# EAGLE design DAC STM32 Board v3 (EAGLE 9.3.1)
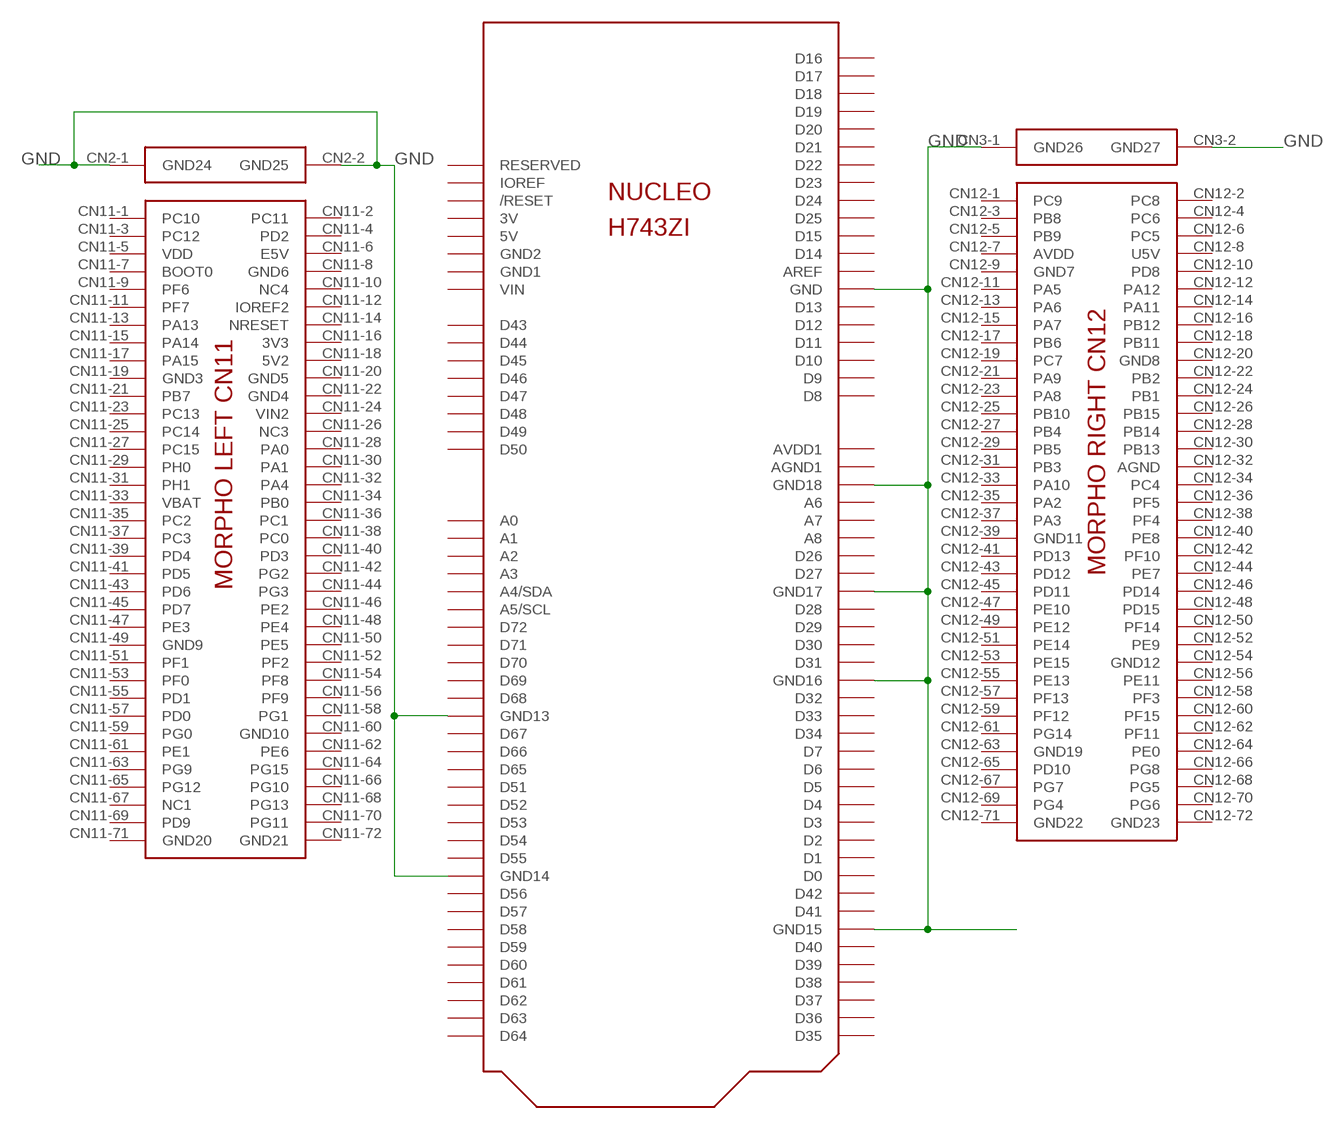
[diagram p0: schematic, sheet 1, part 1 of 2]
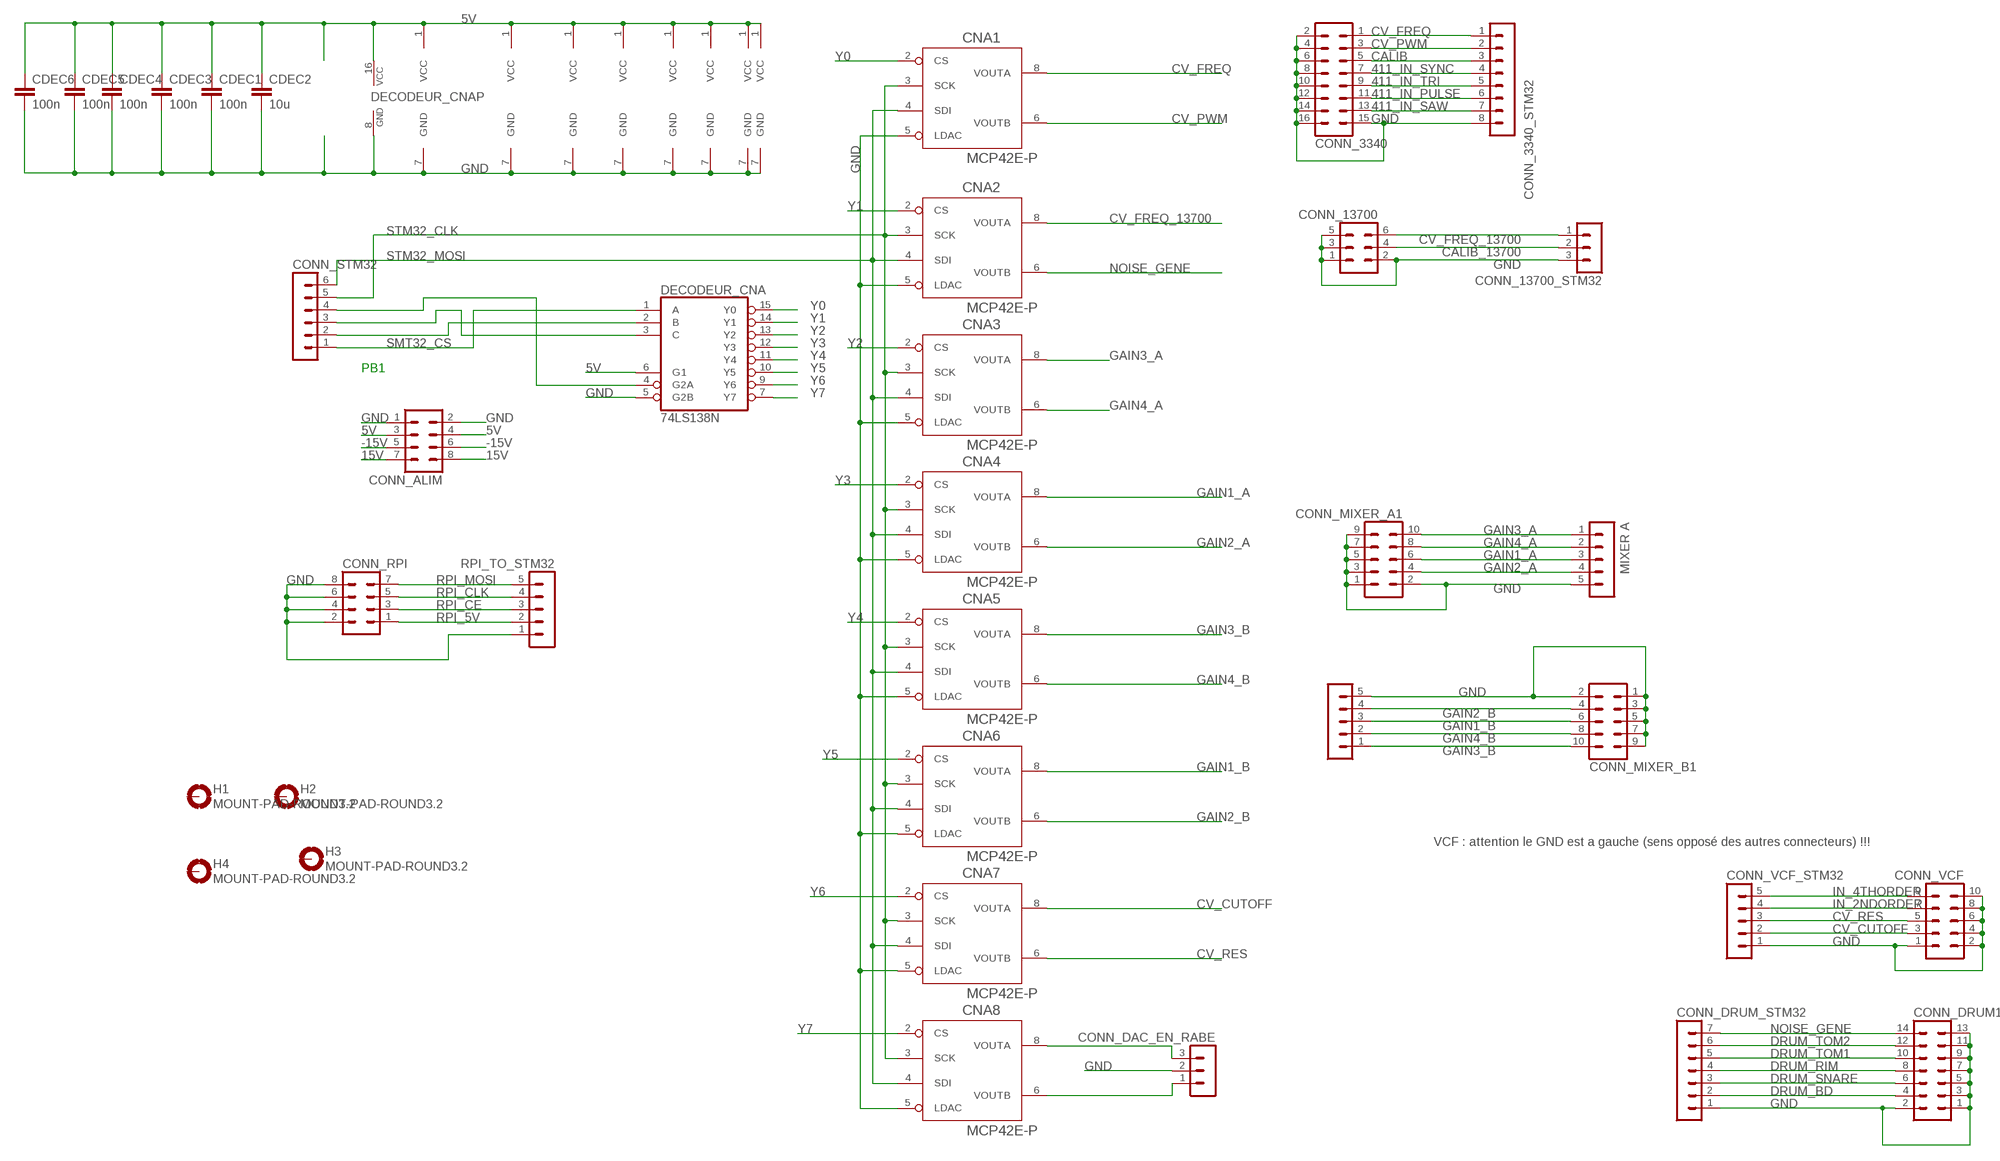
[diagram p1: schematic, sheet 1, part 2 of 2]

## Parts
CDEC1  100n  C-EU050-025X075  [C050-025X075]
CDEC2  10u  C-EU050-025X075  [C050-025X075]
CDEC3  100n  C-EU075-032X103  [C075-032X103]
CDEC4  100n  C-EU075-032X103  [C075-032X103]
CDEC5  100n  C-EU075-032X103  [C075-032X103]
CDEC6  100n  C-EU075-032X103  [C075-032X103]
CNA1  MCP42E-P  [DIL08]
CNA2  MCP42E-P  [DIL08]
CNA3  MCP42E-P  [DIL08]
CNA4  MCP42E-P  [DIL08]
CNA5  MCP42E-P  [DIL08]
CNA6  MCP42E-P  [DIL08]
CNA7  MCP42E-P  [DIL08]
CNA8  MCP42E-P  [DIL08]
CONN_3340  MA08-2  [MA08-2]
CONN_3340_STM32  MA08-1  [MA08-1]
CONN_13700  MA03-2  [MA03-2]
CONN_13700_STM32  MA03-1  [MA03-1]
CONN_ALIM  MA04-2  [MA04-2]
CONN_DAC_EN_RABE  MA03-1  [MA03-1]
CONN_DRUM1  MA07-2  [MA07-2]
CONN_DRUM_STM32  MA07-1  [MA07-1]
CONN_MIXER_A1  MA05-2  [MA05-2]
CONN_MIXER_A_STM32  MA05-1  [MA05-1]
CONN_MIXER_B1  MA05-2  [MA05-2]
CONN_MIXER_B_STM32  MA05-1  [MA05-1]
CONN_RPI  MA04-2  [MA04-2]
CONN_STM32  MA06-1  [MA06-1]
CONN_VCF  MA05-2  [MA05-2]
CONN_VCF_STM32  MA05-1  [MA05-1]
DECODEUR_CNA  74LS138N  [DIL16]
H1  MOUNT-PAD-ROUND3.2  [3,2-PAD]
H2  MOUNT-PAD-ROUND3.2  [3,2-PAD]
H3  MOUNT-PAD-ROUND3.2  [3,2-PAD]
H4  MOUNT-PAD-ROUND3.2  [3,2-PAD]
RPI_TO_STM32  MA05-1  [MA05-1]
U$1  NUCLEO_H743ZI  [NUCLEO_BRD144]

## Nets
5V: CDEC1.1 CDEC2.1 CDEC3.1 CDEC4.1 CDEC5.1 CDEC6.1 CNA1.1(VCC) CNA2.1(VCC) CNA3.1(VCC) CNA4.1(VCC) CNA5.1(VCC) CNA6.1(VCC) CNA7.1(VCC) CNA8.1(VCC) CONN_ALIM.3 CONN_ALIM.4 DECODEUR_CNA.6(G1) DECODEUR_CNA.16(VCC)
15V: CONN_ALIM.7 CONN_ALIM.8
411_IN_PULSE: CONN_3340.11 CONN_3340_STM32.6
411_IN_SAW: CONN_3340.13 CONN_3340_STM32.7
411_IN_SYNC: CONN_3340.7 CONN_3340_STM32.4
411_IN_TRI: CONN_3340.9 CONN_3340_STM32.5
-15V: CONN_ALIM.5 CONN_ALIM.6
CALIB: CONN_3340.5 CONN_3340_STM32.3
CALIB_13700: CONN_13700.4 CONN_13700_STM32.2
CV_CUTOFF: CNA7.8(VOUTA) CONN_VCF.3 CONN_VCF_STM32.2
CV_FREQ: CNA1.8(VOUTA) CONN_3340.1 CONN_3340_STM32.1
CV_FREQ_13700: CNA2.8(VOUTA) CONN_13700.6 CONN_13700_STM32.1
CV_PWM: CNA1.6(VOUTB) CONN_3340.3 CONN_3340_STM32.2
CV_RES: CNA7.6(VOUTB) CONN_VCF.5 CONN_VCF_STM32.3
DRUM_BD: CONN_DRUM1.4 CONN_DRUM_STM32.2
DRUM_RIM: CONN_DRUM1.8 CONN_DRUM_STM32.4
DRUM_SNARE: CONN_DRUM1.6 CONN_DRUM_STM32.3
DRUM_TOM1: CONN_DRUM1.10 CONN_DRUM_STM32.5
DRUM_TOM2: CONN_DRUM1.12 CONN_DRUM_STM32.6
GAIN1_A: CNA4.8(VOUTA) CONN_MIXER_A1.6 CONN_MIXER_A_STM32.3
GAIN1_B: CNA6.8(VOUTA) CONN_MIXER_B1.6 CONN_MIXER_B_STM32.3
GAIN2_A: CNA4.6(VOUTB) CONN_MIXER_A1.4 CONN_MIXER_A_STM32.4
GAIN2_B: CNA6.6(VOUTB) CONN_MIXER_B1.4 CONN_MIXER_B_STM32.4
GAIN3_A: CNA3.8(VOUTA) CONN_MIXER_A1.10 CONN_MIXER_A_STM32.1
GAIN3_B: CNA5.8(VOUTA) CONN_MIXER_B1.10 CONN_MIXER_B_STM32.1
GAIN4_A: CNA3.6(VOUTB) CONN_MIXER_A1.8 CONN_MIXER_A_STM32.2
GAIN4_B: CNA5.6(VOUTB) CONN_MIXER_B1.8 CONN_MIXER_B_STM32.2
GND: CDEC1.2 CDEC2.2 CDEC3.2 CDEC4.2 CDEC5.2 CDEC6.2 CNA1.5(LDAC) CNA1.7(GND) CNA2.5(LDAC) CNA2.7(GND) CNA3.5(LDAC) CNA3.7(GND) CNA4.5(LDAC) CNA4.7(GND) CNA5.5(LDAC) CNA5.7(GND) CNA6.5(LDAC) CNA6.7(GND) CNA7.5(LDAC) CNA7.7(GND) CNA8.5(LDAC) CNA8.7(GND) CONN_3340.2 CONN_3340.4 CONN_3340.6 CONN_3340.8 CONN_3340.10 CONN_3340.12 CONN_3340.14 CONN_3340.15 CONN_3340.16 CONN_3340_STM32.8 CONN_13700.1 CONN_13700.2 CONN_13700.3 CONN_13700.5 CONN_13700_STM32.3 CONN_ALIM.1 CONN_ALIM.2 CONN_DAC_EN_RABE.2 CONN_DRUM1.1 CONN_DRUM1.2 CONN_DRUM1.3 CONN_DRUM1.5 CONN_DRUM1.7 CONN_DRUM1.9 CONN_DRUM1.11 CONN_DRUM1.13 CONN_DRUM_STM32.1 CONN_MIXER_A1.1 CONN_MIXER_A1.2 CONN_MIXER_A1.3 CONN_MIXER_A1.5 CONN_MIXER_A1.7 CONN_MIXER_A1.9 CONN_MIXER_A_STM32.5 CONN_MIXER_B1.1 CONN_MIXER_B1.2 CONN_MIXER_B1.3 CONN_MIXER_B1.5 CONN_MIXER_B1.7 CONN_MIXER_B1.9 CONN_MIXER_B_STM32.5 CONN_RPI.2 CONN_RPI.4 CONN_RPI.6 CONN_RPI.8 CONN_VCF.1 CONN_VCF.2 CONN_VCF.4 CONN_VCF.6 CONN_VCF.8 CONN_VCF.10 CONN_VCF_STM32.1 DECODEUR_CNA.5(G2B) DECODEUR_CNA.8(GND) RPI_TO_STM32.1 U$1.CN2-1(GND24) U$1.CN2-2(GND25) U$1.CN3-1(GND26) U$1.CN3-2(GND27) U$1.CN7-8(GND) U$1.CN9-12(GND14) U$1.CN9-23(GND13) U$1.CN10-5(GND18) U$1.CN10-17(GND17) U$1.CN10-22(GND15) U$1.CN10-27(GND16)
IN_2NDORDER: CONN_VCF.7 CONN_VCF_STM32.4
IN_4THORDER: CONN_VCF.9 CONN_VCF_STM32.5
N$1: CONN_STM32.1 DECODEUR_CNA.1(A)
N$2: CONN_STM32.2 DECODEUR_CNA.2(B)
N$3: CONN_STM32.3 DECODEUR_CNA.3(C)
N$7: CNA8.8(VOUTA) CONN_DAC_EN_RABE.3
N$8: CNA8.6(VOUTB) CONN_DAC_EN_RABE.1
NOISE_GENE: CNA2.6(VOUTB) CONN_DRUM1.14 CONN_DRUM_STM32.7
RPI_5V: CONN_RPI.1 RPI_TO_STM32.2
RPI_CE: CONN_RPI.3 RPI_TO_STM32.3
RPI_CLK: CONN_RPI.5 RPI_TO_STM32.4
RPI_MOSI: CONN_RPI.7 RPI_TO_STM32.5
SMT32_CS: CONN_STM32.4 DECODEUR_CNA.4(G2A)
STM32_CLK: CNA1.3(SCK) CNA2.3(SCK) CNA3.3(SCK) CNA4.3(SCK) CNA5.3(SCK) CNA6.3(SCK) CNA7.3(SCK) CNA8.3(SCK) CONN_STM32.5
STM32_MOSI: CNA1.4(SDI) CNA2.4(SDI) CNA3.4(SDI) CNA4.4(SDI) CNA5.4(SDI) CNA6.4(SDI) CNA7.4(SDI) CNA8.4(SDI) CONN_STM32.6
Y0: CNA1.2(CS) DECODEUR_CNA.15(Y0)
Y1: CNA2.2(CS) DECODEUR_CNA.14(Y1)
Y2: CNA3.2(CS) DECODEUR_CNA.13(Y2)
Y3: CNA4.2(CS) DECODEUR_CNA.12(Y3)
Y4: CNA5.2(CS) DECODEUR_CNA.11(Y4)
Y5: CNA6.2(CS) DECODEUR_CNA.10(Y5)
Y6: CNA7.2(CS) DECODEUR_CNA.9(Y6)
Y7: CNA8.2(CS) DECODEUR_CNA.7(Y7)
Unconnected: H1.B3,2(MOUNT) H2.B3,2(MOUNT) H3.B3,2(MOUNT) H4.B3,2(MOUNT) U$1.CN7-1(D16) U$1.CN7-2(D15) U$1.CN7-3(D17) U$1.CN7-4(D14) U$1.CN7-5(D18) U$1.CN7-6(AREF) U$1.CN7-7(D19) U$1.CN7-9(D20) U$1.CN7-10(D13) U$1.CN7-12(D12) U$1.CN7-13(D22) U$1.CN7-14(D11) U$1.CN7-15(D23) U$1.CN7-16(D10) U$1.CN7-17(D24) U$1.CN7-18(D9) U$1.CN7-19(D25) U$1.CN7-20(D8) U$1.CN8-1(RESERVED) U$1.CN8-2(D43) U$1.CN8-3(IOREF) U$1.CN8-4(D44) U$1.CN8-5(/RESET) U$1.CN8-6(D45) U$1.CN8-8(D46) U$1.CN8-10(D47) U$1.CN8-12(D48) U$1.CN8-14(D49) U$1.CN8-16(D50) U$1.CN9-1(A0) U$1.CN9-2(D51) U$1.CN9-3(A1) U$1.CN9-4(D52) U$1.CN9-5(A2) U$1.CN9-6(D53) U$1.CN9-7(A3) U$1.CN9-8(D54) U$1.CN9-9(A4/SDA) U$1.CN9-10(D55) U$1.CN9-11(A5/SCL) U$1.CN9-13(D72) U$1.CN9-14(D56) U$1.CN9-15(D71) U$1.CN9-16(D57) U$1.CN9-17(D70) U$1.CN9-18(D58) U$1.CN9-19(D69) U$1.CN9-20(D59) U$1.CN9-21(D68) U$1.CN9-22(D60) U$1.CN9-24(D61) U$1.CN9-25(D67) U$1.CN9-26(D62) U$1.CN9-27(D66) U$1.CN9-28(D63) U$1.CN9-29(D65) U$1.CN9-30(D64) U$1.CN10-1(AVDD1) U$1.CN10-2(D7) U$1.CN10-3(AGND1) U$1.CN10-4(D6) U$1.CN10-6(D5) U$1.CN10-7(A6) U$1.CN10-8(D4) U$1.CN10-9(A7) U$1.CN10-10(D3) U$1.CN10-11(A8) U$1.CN10-12(D2) U$1.CN10-13(D26) U$1.CN10-14(D1) U$1.CN10-15(D27) U$1.CN10-16(D0) U$1.CN10-18(D42) U$1.CN10-19(D28) U$1.CN10-20(D41) U$1.CN10-21(D29) U$1.CN10-23(D30) U$1.CN10-24(D40) U$1.CN10-25(D31) U$1.CN10-26(D39) U$1.CN10-28(D38) U$1.CN10-29(D32) U$1.CN10-30(D37) U$1.CN10-31(D33) U$1.CN10-32(D36) U$1.CN10-33(D34) U$1.CN10-34(D35) U$1.CN11-1(PC10) U$1.CN11-2(PC11) U$1.CN11-3(PC12) U$1.CN11-4(PD2) U$1.CN11-7(BOOT0) U$1.CN11-9(PF6) U$1.CN11-10(NC4) U$1.CN11-11(PF7) U$1.CN11-12(IOREF2) U$1.CN11-13(PA13) U$1.CN11-14(NRESET) U$1.CN11-15(PA14) U$1.CN11-17(PA15) U$1.CN11-21(PB7) U$1.CN11-23(PC13) U$1.CN11-25(PC14) U$1.CN11-26(NC3) U$1.CN11-27(PC15) U$1.CN11-28(PA0) U$1.CN11-29(PH0) U$1.CN11-30(PA1) U$1.CN11-31(PH1) U$1.CN11-32(PA4) U$1.CN11-34(PB0) U$1.CN11-35(PC2) U$1.CN11-36(PC1) U$1.CN11-37(PC3) U$1.CN11-38(PC0) U$1.CN11-39(PD4) U$1.CN11-40(PD3) U$1.CN11-41(PD5) U$1.CN11-42(PG2) U$1.CN11-43(PD6) U$1.CN11-44(PG3) U$1.CN11-45(PD7) U$1.CN11-46(PE2) U$1.CN11-47(PE3) U$1.CN11-48(PE4) U$1.CN11-49(GND9) U$1.CN11-50(PE5) U$1.CN11-51(PF1) U$1.CN11-52(PF2) U$1.CN11-53(PF0) U$1.CN11-54(PF8) U$1.CN11-55(PD1) U$1.CN11-56(PF9) U$1.CN11-57(PD0) U$1.CN11-58(PG1) U$1.CN11-59(PG0) U$1.CN11-60(GND10) U$1.CN11-61(PE1) U$1.CN11-62(PE6) U$1.CN11-63(PG9) U$1.CN11-64(PG15) U$1.CN11-65(PG12) U$1.CN11-66(PG10) U$1.CN11-67(NC1) U$1.CN11-68(PG13) U$1.CN11-69(PD9) U$1.CN11-70(PG11) U$1.CN11-71(GND20) U$1.CN11-72(GND21) U$1.CN12-1(PC9) U$1.CN12-2(PC8) U$1.CN12-3(PB8) U$1.CN12-4(PC6) U$1.CN12-5(PB9) U$1.CN12-6(PC5) U$1.CN12-10(PD8) U$1.CN12-11(PA5) U$1.CN12-12(PA12) U$1.CN12-13(PA6) U$1.CN12-14(PA11) U$1.CN12-15(PA7) U$1.CN12-16(PB12) U$1.CN12-17(PB6) U$1.CN12-18(PB11) U$1.CN12-19(PC7) U$1.CN12-21(PA9) U$1.CN12-22(PB2) U$1.CN12-23(PA8) U$1.CN12-24(PB1) U$1.CN12-25(PB10) U$1.CN12-26(PB15) U$1.CN12-27(PB4) U$1.CN12-28(PB14) U$1.CN12-29(PB5) U$1.CN12-30(PB13) U$1.CN12-31(PB3) U$1.CN12-33(PA10) U$1.CN12-34(PC4) U$1.CN12-35(PA2) U$1.CN12-36(PF5) U$1.CN12-37(PA3) U$1.CN12-38(PF4) U$1.CN12-39(GND11) U$1.CN12-40(PE8) U$1.CN12-41(PD13) U$1.CN12-42(PF10) U$1.CN12-43(PD12) U$1.CN12-44(PE7) U$1.CN12-45(PD11) U$1.CN12-46(PD14) U$1.CN12-47(PE10) U$1.CN12-48(PD15) U$1.CN12-49(PE12) U$1.CN12-50(PF14) U$1.CN12-51(PE14) U$1.CN12-52(PE9) U$1.CN12-53(PE15) U$1.CN12-54(GND12) U$1.CN12-55(PE13) U$1.CN12-56(PE11) U$1.CN12-57(PF13) U$1.CN12-58(PF3) U$1.CN12-59(PF12) U$1.CN12-60(PF15) U$1.CN12-61(PG14) U$1.CN12-62(PF11) U$1.CN12-63(GND19) U$1.CN12-64(PE0) U$1.CN12-65(PD10) U$1.CN12-66(PG8) U$1.CN12-67(PG7) U$1.CN12-68(PG5) U$1.CN12-69(PG4) U$1.CN12-70(PG6) U$1.CN12-71(GND22) U$1.CN12-72(GND23)

## Notes on the sheet
- PB1
- MIXER A
- VCF : attention le GND est a gauche (sens opposé des autres connecteurs) !!!

## Power pins joined to a net without a drawn wire
3V: U$1.CN8-7(3V)
3V3: U$1.CN11-16(3V3)
5V: U$1.CN8-9(5V)
5V2: U$1.CN11-18(5V2)
AGND: U$1.CN12-32(AGND)
AVDD: U$1.CN12-7(AVDD)
D21: U$1.CN7-11(D21)
E5V: U$1.CN11-6(E5V)
GND1: U$1.CN8-13(GND1)
GND2: U$1.CN8-11(GND2)
GND3: U$1.CN11-19(GND3)
GND4: U$1.CN11-22(GND4)
GND5: U$1.CN11-20(GND5)
GND6: U$1.CN11-8(GND6)
GND7: U$1.CN12-9(GND7)
GND8: U$1.CN12-20(GND8)
U5V: U$1.CN12-8(U5V)
VBAT: U$1.CN11-33(VBAT)
VDD: U$1.CN11-5(VDD)
VIN: U$1.CN8-15(VIN)
VIN2: U$1.CN11-24(VIN2)

## Library data of the parts
CDEC1-CDEC6 = 6P1_EVB:C-EU: CAPACITOR, European symbol
CNA1-CNA8 = dac:MCP4*2: DAC 8BIT DUAL SPI/VREF
CONN_3340 = con-lstb:MA08-2: PIN HEADER; OC_FARNELL: unknown; OC_NEWARK: unknown
CONN_3340_STM32 = con-lstb:MA08-1: PIN HEADER; OC_FARNELL: unknown; OC_NEWARK: unknown
CONN_13700 = con-lstb:MA03-2: PIN HEADER; OC_FARNELL: unknown; OC_NEWARK: unknown
CONN_13700_STM32 CONN_DAC_EN_RABE = con-lstb:MA03-1: PIN HEADER; OC_FARNELL: unknown; OC_NEWARK: unknown
CONN_ALIM CONN_RPI = con-lstb:MA04-2: PIN HEADER; OC_FARNELL: unknown; OC_NEWARK: unknown
CONN_DRUM1 = con-lstb:MA07-2: PIN HEADER; OC_FARNELL: unknown; OC_NEWARK: unknown
CONN_DRUM_STM32 = con-lstb:MA07-1: PIN HEADER; OC_FARNELL: unknown; OC_NEWARK: unknown
CONN_MIXER_A1 CONN_MIXER_B1 CONN_VCF = con-lstb:MA05-2: PIN HEADER; OC_FARNELL: unknown; OC_NEWARK: unknown
CONN_MIXER_A_STM32 CONN_MIXER_B_STM32 CONN_VCF_STM32 RPI_TO_STM32 = con-lstb:MA05-1: PIN HEADER; OC_FARNELL: unknown; OC_NEWARK: unknown
CONN_STM32 = con-lstb:MA06-1: PIN HEADER; OC_FARNELL: unknown; OC_NEWARK: unknown
DECODEUR_CNA = 74xx-eu:74*138: 3-line to 8-line DECODER/DEMULTIPLEXER
H1-H4 = holes:MOUNT-PAD-ROUND: MOUNTING PAD, round
U$1 = Stm32nucleoF411:NUCLEO_H743ZI

## Board
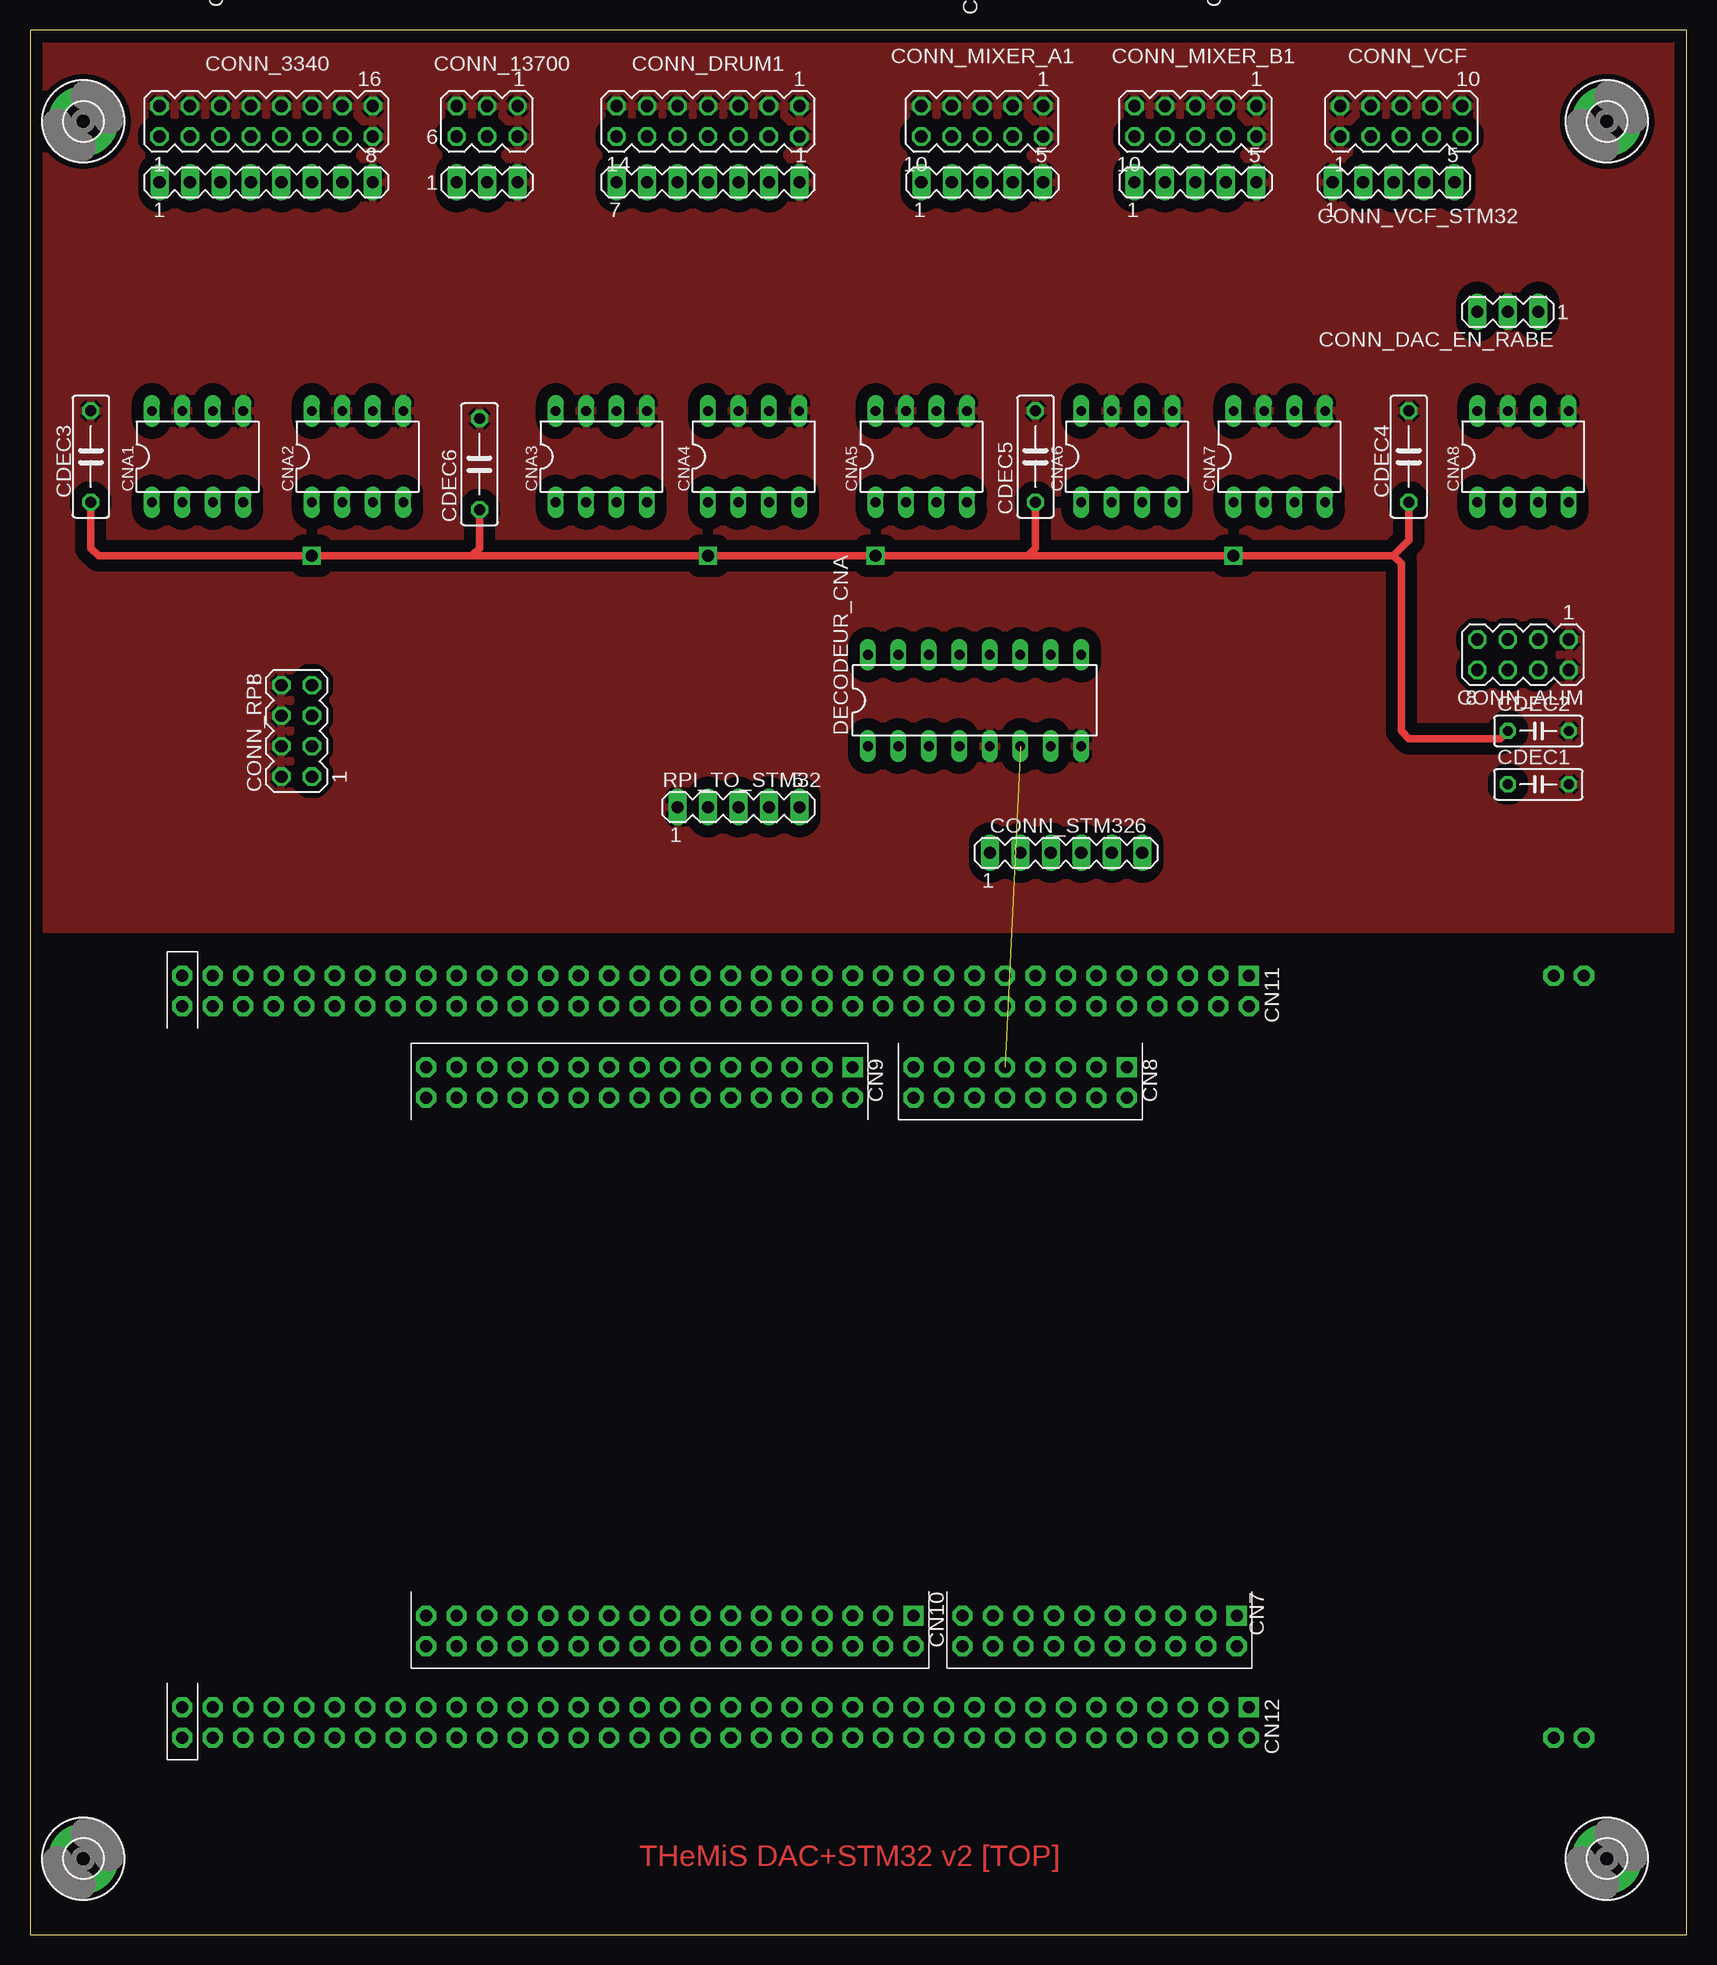
[diagram p2: board, top side]
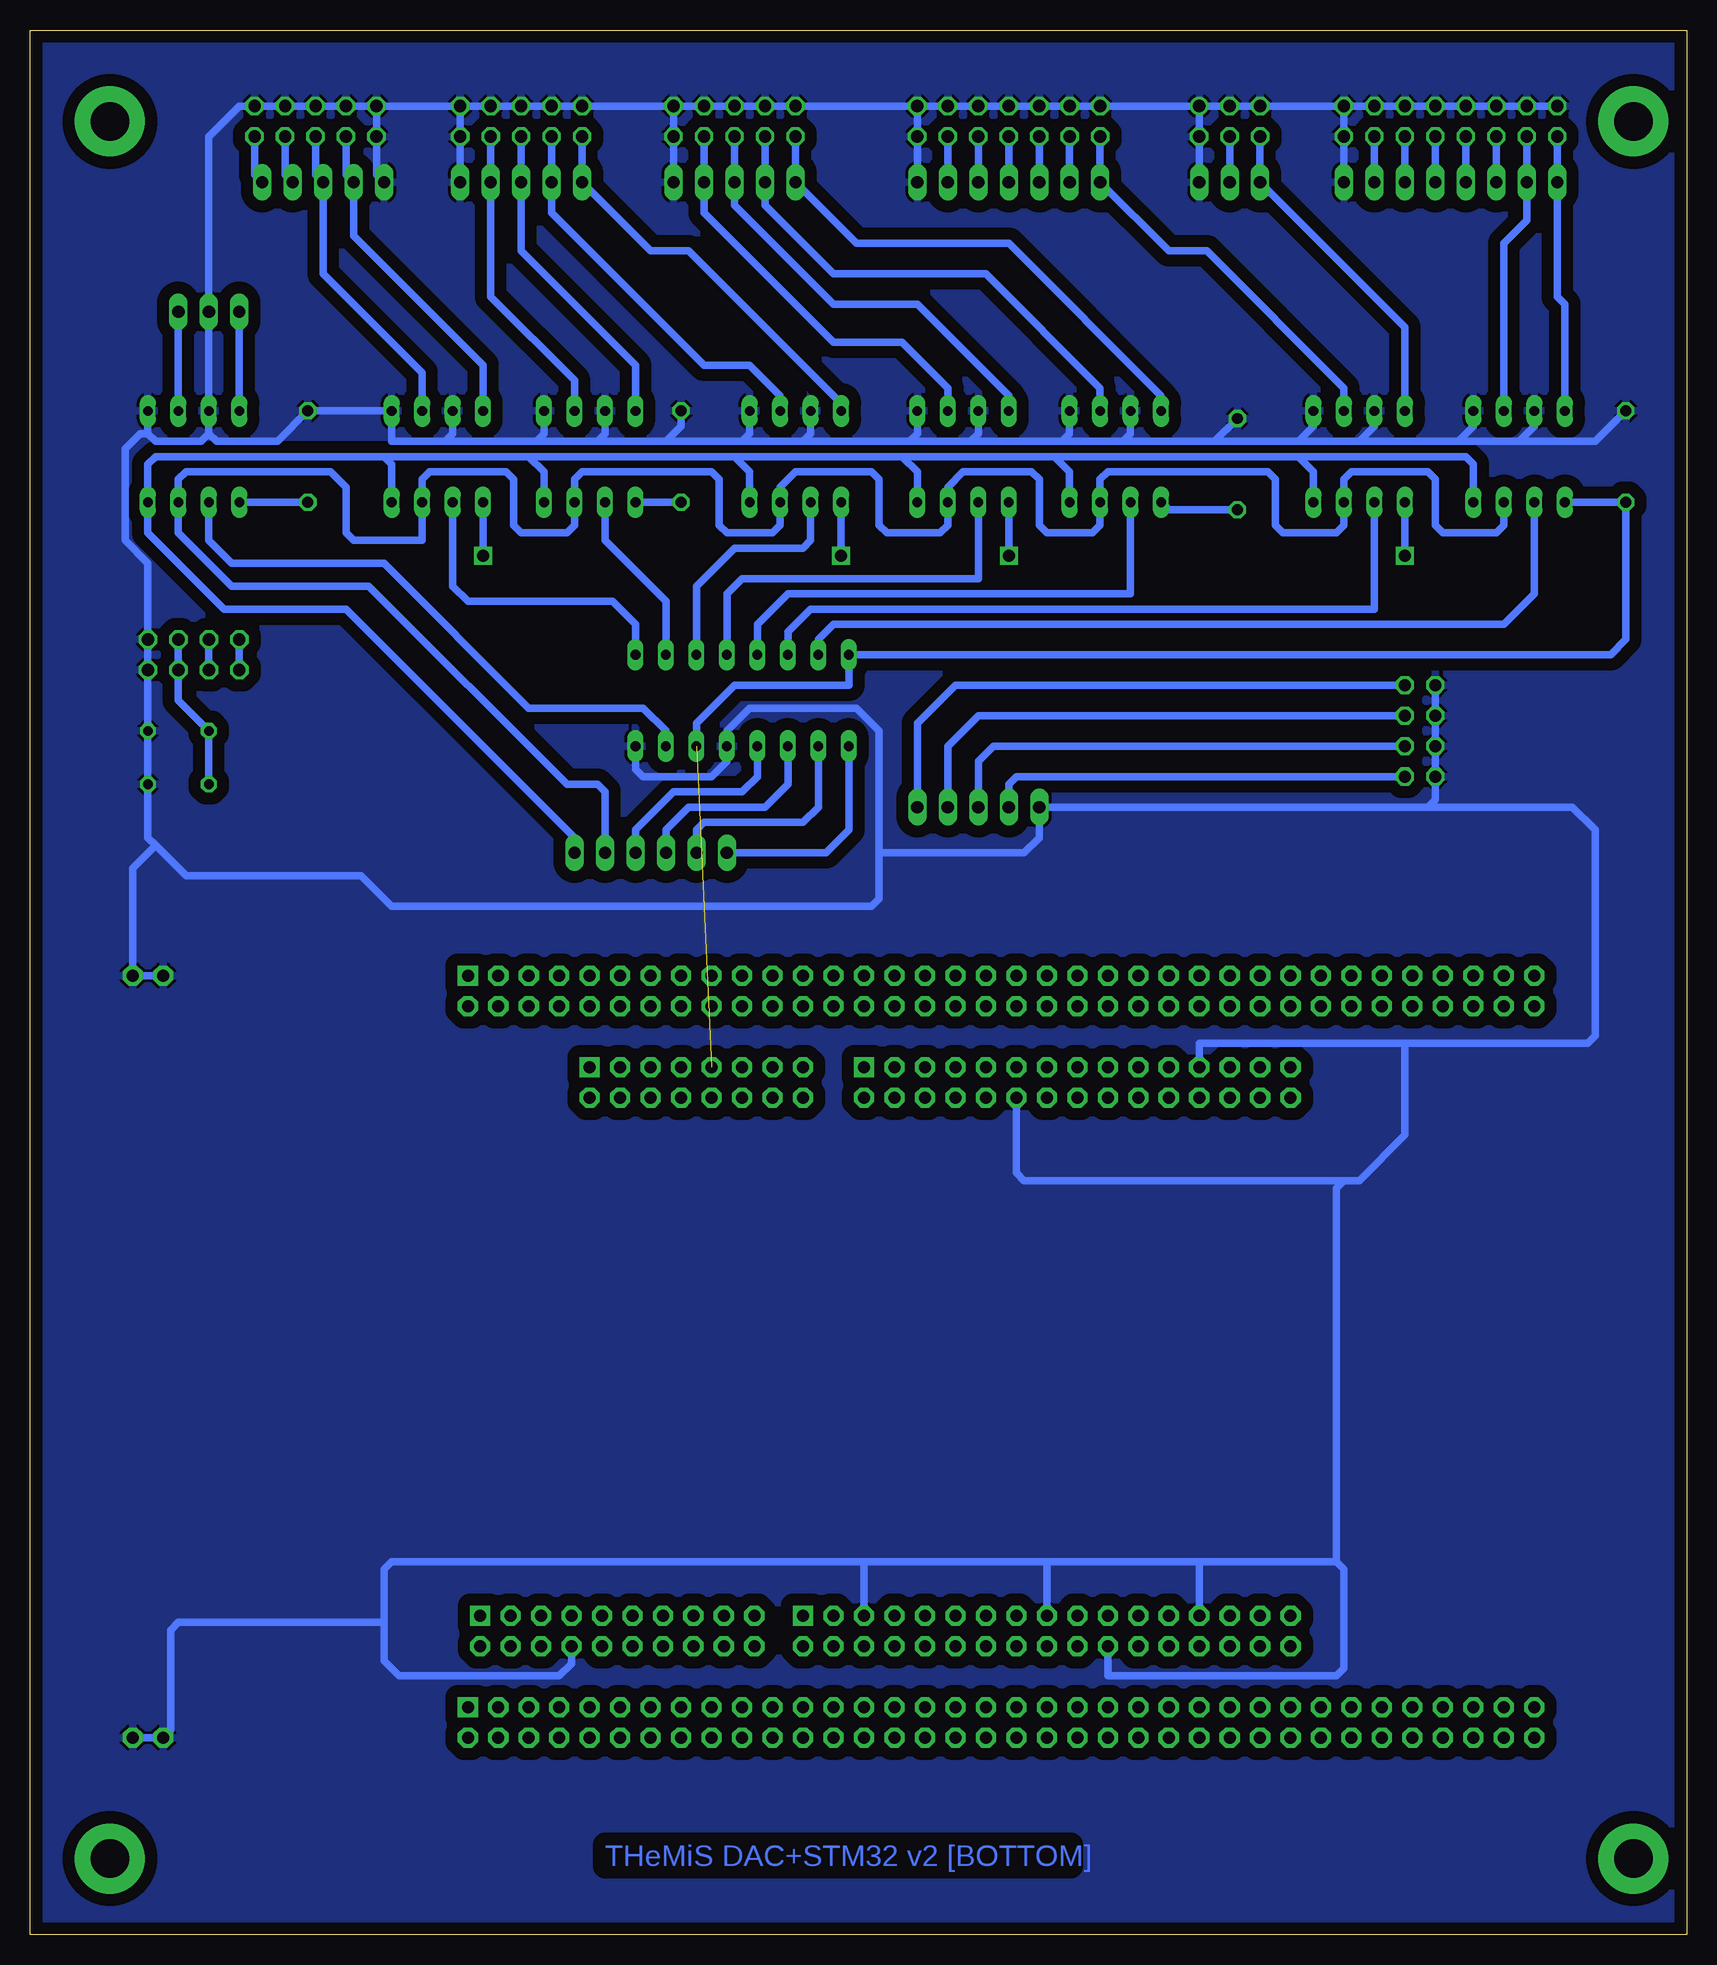
[diagram p3: board, bottom side, seen from below]

Size 138.1 x 158.74 mm. Coordinates in mm from the lower left corner, seen from the top.
Outline: 0,0 138.1,0 138.1,158.74 0,158.74 0,0
Copper layers (1*16): Top 0.035mm / dielectric 1.5mm / Bottom 0.035mm
Design rules "default *": minimum track width 0.5mm, minimum drill 0.35mm, track to track 0.5mm, track to pad 0.5mm, pad to pad 0.5mm, via to via 0.5mm, smd to smd 0.5mm, copper to edge 40mil, drill to drill 6mil, minimum pad ring 10mil, minimum via ring 8mil, stop-mask expansion 4mil, vias tented up to drill 0mil, thermal gap 10mil

### Footprints (pad centres in the part's own frame; a part is rotated, then mirrored left to right if it is on the bottom)
C050-025X075 = drill 0.813 octagon: 1 -2.54,0; 2 2.54,0
C075-032X103 = drill 0.914 octagon: 1 -3.81,0; 2 3.81,0
DIL08 = drill 0.813 long: 1 -3.81,-3.81; 2 -1.27,-3.81; 3 1.27,-3.81; 4 3.81,-3.81; 5 3.81,3.81; 6 1.27,3.81; 7 -1.27,3.81; 8 -3.81,3.81
MA08-2 = drill 1.016 octagon: 1 -8.89,-1.27; 2 -8.89,1.27; 3 -6.35,-1.27; 4 -6.35,1.27; 5 -3.81,-1.27; 6 -3.81,1.27; 7 -1.27,-1.27; 8 -1.27,1.27; 9 1.27,-1.27; 10 1.27,1.27; 11 3.81,-1.27; 12 3.81,1.27; 13 6.35,-1.27; 14 6.35,1.27; 15 8.89,-1.27; 16 8.89,1.27
MA08-1 = drill 1.016 long: 1 -8.89,0; 2 -6.35,0; 3 -3.81,0; 4 -1.27,0; 5 1.27,0; 6 3.81,0; 7 6.35,0; 8 8.89,0
MA03-2 = drill 1.016: 1 -2.54,-1.27 | drill 1.016 octagon: 2 -2.54,1.27; 3 0,-1.27; 4 0,1.27; 5 2.54,-1.27; 6 2.54,1.27
MA03-1 = drill 1.016 long: 1 -2.54,0; 2 0,0; 3 2.54,0
MA04-2 = drill 1.016 octagon: 1 -3.81,-1.27; 2 -3.81,1.27; 3 -1.27,-1.27; 4 -1.27,1.27; 5 1.27,-1.27; 6 1.27,1.27; 7 3.81,-1.27; 8 3.81,1.27
MA07-2 = drill 1.016 octagon: 1 -7.62,-1.27; 2 -7.62,1.27; 3 -5.08,-1.27; 4 -5.08,1.27; 5 -2.54,-1.27; 6 -2.54,1.27; 7 0,-1.27; 8 0,1.27; 9 2.54,-1.27; 10 2.54,1.27; 11 5.08,-1.27; 12 5.08,1.27; 13 7.62,-1.27; 14 7.62,1.27
MA07-1 = drill 1.016 long: 1 -7.62,0; 2 -5.08,0; 3 -2.54,0; 4 0,0; 5 2.54,0; 6 5.08,0; 7 7.62,0
MA05-2 = drill 1.016 octagon: 1 -5.08,-1.27; 2 -5.08,1.27; 3 -2.54,-1.27; 4 -2.54,1.27; 5 0,-1.27; 6 0,1.27; 7 2.54,-1.27; 8 2.54,1.27; 9 5.08,-1.27; 10 5.08,1.27
MA05-1 = drill 1.016 long: 1 -5.08,0; 2 -2.54,0; 3 0,0; 4 2.54,0; 5 5.08,0
MA06-1 = drill 1.016 long: 1 -6.35,0; 2 -3.81,0; 3 -1.27,0; 4 1.27,0; 5 3.81,0; 6 6.35,0
DIL16 = drill 0.813 long: 1 -8.89,-3.81; 2 -6.35,-3.81; 3 -3.81,-3.81; 4 -1.27,-3.81; 5 1.27,-3.81; 6 3.81,-3.81; 7 6.35,-3.81; 8 8.89,-3.81; 9 8.89,3.81; 10 6.35,3.81; 11 3.81,3.81; 12 1.27,3.81; 13 -1.27,3.81; 14 -3.81,3.81; 15 -6.35,3.81; 16 -8.89,3.81
3,2-PAD = drill 3.2 pad 5.842: B3,2 0,0
NUCLEO_BRD144 = drill 1 pad 1.676 octagon: CN2-1 3.25,129.54; CN2-2 3.25,127; CN3-1 66.75,129.54; CN3-2 66.75,127; CN7-2 59.13,100.584; CN7-3 56.59,98.044; CN7-4 59.13,98.044; CN7-5 56.59,95.504; CN7-6 59.13,95.504; CN7-7 56.59,92.964; CN7-8 59.13,92.964; CN7-9 56.59,90.424; CN7-10 59.13,90.424; CN7-11 56.59,87.884; CN7-12 59.13,87.884; CN7-13 56.59,85.344; CN7-14 59.13,85.344; CN7-15 56.59,82.804; CN7-16 59.13,82.804; CN7-17 56.59,80.264; CN7-18 59.13,80.264; CN7-19 56.59,77.724; CN7-20 59.13,77.724; CN8-2 13.41,91.44; CN8-3 10.87,88.9; CN8-4 13.41,88.9; CN8-5 10.87,86.36; CN8-6 13.41,86.36; CN8-7 10.87,83.82; CN8-8 13.41,83.82; CN8-9 10.87,81.28; CN8-10 13.41,81.28; CN8-11 10.87,78.74; CN8-12 13.41,78.74; CN8-13 10.87,76.2; CN8-14 13.41,76.2; CN8-15 10.87,73.66; CN8-16 13.41,73.66; CN9-2 13.41,68.58; CN9-3 10.87,66.04; CN9-4 13.41,66.04; CN9-5 10.87,63.5; CN9-6 13.41,63.5; CN9-7 10.87,60.96; CN9-8 13.41,60.96; CN9-9 10.87,58.42; CN9-10 13.41,58.42; CN9-11 10.87,55.88; CN9-12 13.41,55.88; CN9-13 10.87,53.34; CN9-14 13.41,53.34; CN9-15 10.87,50.8; CN9-16 13.41,50.8; CN9-17 10.87,48.26; CN9-18 13.41,48.26; CN9-19 10.87,45.72; CN9-20 13.41,45.72; CN9-21 10.87,43.18; CN9-22 13.41,43.18; CN9-23 10.87,40.64; CN9-24 13.41,40.64; CN9-25 10.87,38.1; CN9-26 13.41,38.1; CN9-27 10.87,35.56; CN9-28 13.41,35.56; CN9-29 10.87,33.02; CN9-30 13.41,33.02; CN10-2 59.13,73.66; CN10-3 56.59,71.12; CN10-4 59.13,71.12; CN10-5 56.59,68.58; CN10-6 59.13,68.58; CN10-7 56.59,66.04; CN10-8 59.13,66.04; CN10-9 56.59,63.5; CN10-10 59.13,63.5; CN10-11 56.59,60.96; CN10-12 59.13,60.96; CN10-13 56.59,58.42; CN10-14 59.13,58.42; CN10-15 56.59,55.88; CN10-16 59.13,55.88; CN10-17 56.59,53.34; CN10-18 59.13,53.34; CN10-19 56.59,50.8; CN10-20 59.13,50.8; CN10-21 56.59,48.26; CN10-22 59.13,48.26; CN10-23 56.59,45.72; CN10-24 59.13,45.72; CN10-25 56.59,43.18; CN10-26 59.13,43.18; CN10-27 56.59,40.64; CN10-28 59.13,40.64; CN10-29 56.59,38.1; CN10-30 59.13,38.1; CN10-31 56.59,35.56; CN10-32 59.13,35.56; CN10-33 56.59,33.02; CN10-34 59.13,33.02; CN11-2 5.79,101.6; CN11-3 3.25,99.06; CN11-4 5.79,99.06; CN11-5 3.25,96.52; CN11-6 5.79,96.52; CN11-7 3.25,93.98; CN11-8 5.79,93.98; CN11-9 3.25,91.44; CN11-10 5.79,91.44; CN11-11 3.25,88.9; CN11-12 5.79,88.9; CN11-13 3.25,86.36; CN11-14 5.79,86.36; CN11-15 3.25,83.82; CN11-16 5.79,83.82; CN11-17 3.25,81.28; CN11-18 5.79,81.28; CN11-19 3.25,78.74; CN11-20 5.79,78.74; CN11-21 3.25,76.2; CN11-22 5.79,76.2; CN11-23 3.25,73.66; CN11-24 5.79,73.66; CN11-25 3.25,71.12; CN11-26 5.79,71.12; CN11-27 3.25,68.58; CN11-28 5.79,68.58; CN11-29 3.25,66.04; CN11-30 5.79,66.04; CN11-31 3.25,63.5; CN11-32 5.79,63.5; CN11-33 3.25,60.96; CN11-34 5.79,60.96; CN11-35 3.25,58.42; CN11-36 5.79,58.42; CN11-37 3.25,55.88; CN11-38 5.79,55.88; CN11-39 3.25,53.34; CN11-40 5.79,53.34; CN11-41 3.25,50.8; CN11-42 5.79,50.8; CN11-43 3.25,48.26; CN11-44 5.79,48.26; CN11-45 3.25,45.72; CN11-46 5.79,45.72; CN11-47 3.25,43.18; CN11-48 5.79,43.18; CN11-49 3.25,40.64; CN11-50 5.79,40.64; CN11-51 3.25,38.1; CN11-52 5.79,38.1; CN11-53 3.25,35.56; CN11-54 5.79,35.56; CN11-55 3.25,33.02; CN11-56 5.79,33.02; CN11-57 3.25,30.48; CN11-58 5.79,30.48; CN11-59 3.25,27.94; CN11-60 5.79,27.94; CN11-61 3.25,25.4; CN11-62 5.79,25.4; CN11-63 3.25,22.86; CN11-64 5.79,22.86; CN11-65 3.25,20.32; CN11-66 5.79,20.32; CN11-67 3.25,17.78; CN11-68 5.79,17.78; CN11-69 3.25,15.24; CN11-70 5.79,15.24; CN11-71 3.25,12.7; CN11-72 5.79,12.7; CN12-2 66.75,101.6; CN12-3 64.21,99.06; CN12-4 66.75,99.06; CN12-5 64.21,96.52; CN12-6 66.75,96.52; CN12-7 64.21,93.98; CN12-8 66.75,93.98; CN12-9 64.21,91.44; CN12-10 66.75,91.44; CN12-11 64.21,88.9; CN12-12 66.75,88.9; CN12-13 64.21,86.36; CN12-14 66.75,86.36; CN12-15 64.21,83.82; CN12-16 66.75,83.82; CN12-17 64.21,81.28; CN12-18 66.75,81.28; CN12-19 64.21,78.74; CN12-20 66.75,78.74; CN12-21 64.21,76.2; CN12-22 66.75,76.2; CN12-23 64.21,73.66; CN12-24 66.75,73.66; CN12-25 64.21,71.12; CN12-26 66.75,71.12; CN12-27 64.21,68.58; CN12-28 66.75,68.58; CN12-29 64.21,66.04; CN12-30 66.75,66.04; CN12-31 64.21,63.5; CN12-32 66.75,63.5; CN12-33 64.21,60.96; CN12-34 66.75,60.96; CN12-35 64.21,58.42; CN12-36 66.75,58.42; CN12-37 64.21,55.88; CN12-38 66.75,55.88; CN12-39 64.21,53.34; CN12-40 66.75,53.34; CN12-41 64.21,50.8; CN12-42 66.75,50.8; CN12-43 64.21,48.26; CN12-44 66.75,48.26; CN12-45 64.21,45.72; CN12-46 66.75,45.72; CN12-47 64.21,43.18; CN12-48 66.75,43.18; CN12-49 64.21,40.64; CN12-50 66.75,40.64; CN12-51 64.21,38.1; CN12-52 66.75,38.1; CN12-53 64.21,35.56; CN12-54 66.75,35.56; CN12-55 64.21,33.02; CN12-56 66.75,33.02; CN12-57 64.21,30.48; CN12-58 66.75,30.48; CN12-59 64.21,27.94; CN12-60 66.75,27.94; CN12-61 64.21,25.4; CN12-62 66.75,25.4; CN12-63 64.21,22.86; CN12-64 66.75,22.86; CN12-65 64.21,20.32; CN12-66 66.75,20.32; CN12-67 64.21,17.78; CN12-68 66.75,17.78; CN12-69 64.21,15.24; CN12-70 66.75,15.24; CN12-71 64.21,12.7; CN12-72 66.75,12.7 | drill 1 pad 1.676 square: CN7-1 56.59,100.584; CN8-1 10.87,91.44; CN9-1 10.87,68.58; CN10-1 56.59,73.66; CN11-1 3.25,101.6; CN12-1 64.21,101.6

### Placement (x,y rotation side)
CDEC1  125.73,95.88 0 top
CDEC2  125.73,100.33 0 top
CDEC3  5.08,123.19 90 top
CDEC4  114.94,123.19 90 top
CDEC5  83.82,123.19 90 top
CDEC6  37.47,122.55 90 top
CNA1  13.97,123.19 0 top
CNA2  27.3,123.19 0 top
CNA3  47.62,123.19 0 top
CNA4  60.33,123.19 0 top
CNA5  74.3,123.19 0 top
CNA6  91.44,123.19 0 top
CNA7  104.14,123.19 0 top
CNA8  124.46,123.19 0 top
CONN_3340  19.69,151.13 0 top
CONN_3340_STM32  19.69,146.05 0 top
CONN_13700  38.1,151.13 180 top
CONN_13700_STM32  38.1,146.05 0 top
CONN_ALIM  124.46,106.68 180 top
CONN_DAC_EN_RABE  123.19,135.25 180 top
CONN_DRUM1  56.52,151.13 180 top
CONN_DRUM_STM32  56.52,146.05 180 top
CONN_MIXER_A1  79.38,151.13 180 top
CONN_MIXER_A_STM32  79.38,146.05 0 top
CONN_MIXER_B1  97.16,151.13 180 top
CONN_MIXER_B_STM32  97.16,146.05 0 top
CONN_RPI  22.23,100.33 90 top
CONN_STM32  86.36,90.17 0 top
CONN_VCF  114.3,151.13 0 top
CONN_VCF_STM32  113.67,146.05 0 top
DECODEUR_CNA  78.74,102.87 0 top
H1  4.45,6.35 0 top
H2  131.44,6.35 0 top
H3  131.44,151.13 0 top
H4  4.45,151.13 0 top
RPI_TO_STM32  59.06,93.98 0 top
U$1  0,83.19 270 top

### Tracks (layer width: path | path; a pad name or v marks a point on that pad's centre or on a via)
5V  (via drill 1)  (1 unrouted)
  Top 0.61: CDEC3.1 5.08,115.57 5.71,114.94 v23.5,114.94 36.83,114.94 | 36.83,114.94 37.47,115.57 CDEC6.1 | 36.83,114.94 v56.52,114.94 v70.48,114.94 83.19,114.94 | 83.19,114.94 83.82,115.57 CDEC5.1 | 83.19,114.94 v100.33,114.94 113.67,114.94 | 113.67,114.94 114.94,116.2 CDEC4.1 | 113.67,114.94 114.3,114.3 114.3,100.33 114.94,99.69 122.56,99.69 CDEC2.1
  Bottom 0.61: CONN_ALIM.3 CONN_ALIM.4 125.73,102.87 CDEC2.1 CDEC1.1 | CNA1.1 CDEC3.1 5.08,107.95 6.35,106.68 DECODEUR_CNA.16 69.85,104.14 79.38,104.14 82.55,100.97 DECODEUR_CNA.6 | CNA8.1 CDEC4.1 | CNA6.1 CDEC5.1 | CDEC6.1 43.18,118.75 CNA3.1 | CNA5.1 v70.48,114.94 | CNA7.1 v100.33,114.94 | CNA4.1 v56.52,114.94 | CNA2.1 v23.5,114.94
15V
  Bottom 0.61: CONN_ALIM.7 CONN_ALIM.8
411_IN_PULSE
  Bottom 0.61: CONN_3340.11 CONN_3340_STM32.6
411_IN_SAW
  Bottom 0.61: CONN_3340.13 CONN_3340_STM32.7
411_IN_SYNC
  Bottom 0.61: CONN_3340.7 CONN_3340_STM32.4
411_IN_TRI
  Bottom 0.61: CONN_3340.9 CONN_3340_STM32.5
-15V
  Bottom 0.61: CONN_ALIM.5 CONN_ALIM.6
CALIB
  Bottom 0.61: CONN_3340.5 CONN_3340_STM32.3
CALIB_13700
  Bottom 0.61: CONN_13700.4 CONN_13700_STM32.2
CV_CUTOFF
  Bottom 0.61: CONN_VCF.3 111.76,146.69 CONN_VCF_STM32.2 111.12,141.6 100.33,130.81 CNA7.8
CV_FREQ
  Bottom 0.61: CONN_3340.1 CONN_3340_STM32.1 10.79,136.52 10.16,135.89 CNA1.8
CV_FREQ_13700
  Bottom 0.61: CONN_13700.6 CONN_13700_STM32.1 23.5,133.98 CNA2.8
CV_PWM
  Bottom 0.61: CONN_3340.3 CONN_3340_STM32.2 13.34,142.88 15.24,140.97 CNA1.6
CV_RES
  Bottom 0.61: CONN_VCF.5 114.3,146.69 CONN_VCF_STM32.3 113.67,138.43 105.41,130.18 CNA7.6
DRUM_BD
  Bottom 0.61: CONN_DRUM1.4 CONN_DRUM_STM32.2
DRUM_RIM
  Bottom 0.61: CONN_DRUM1.8 CONN_DRUM_STM32.4
DRUM_SNARE
  Bottom 0.61: CONN_DRUM1.6 CONN_DRUM_STM32.3
DRUM_TOM1
  Bottom 0.61: CONN_DRUM1.10 CONN_DRUM_STM32.5
DRUM_TOM2
  Bottom 0.61: CONN_DRUM1.12 CONN_DRUM_STM32.6
GAIN1_A
  Bottom 0.61: CONN_MIXER_A1.6 CONN_MIXER_A_STM32.3 79.38,144.14 71.12,135.89 64.14,135.89 56.52,128.27 CNA4.8
GAIN1_B
  Bottom 0.61: CONN_MIXER_B1.6 CONN_MIXER_B_STM32.3 97.16,140.33 87.63,130.81 CNA6.8
GAIN2_A
  Bottom 0.61: CONN_MIXER_A1.4 CONN_MIXER_A_STM32.4 81.92,143.51 71.12,132.72 65.41,132.72 61.59,128.91 CNA4.6
GAIN2_B
  Bottom 0.61: CONN_MIXER_B1.4 CONN_MIXER_B_STM32.4 99.7,136.52 92.71,129.54 CNA6.6
GAIN3_A
  Bottom 0.61: CONN_MIXER_A1.10 CONN_MIXER_A_STM32.1 69.22,140.97 56.52,140.97 43.81,128.27 CNA3.8
GAIN3_B
  Bottom 0.61: CONN_MIXER_B1.10 CONN_MIXER_B_STM32.1 86.36,140.33 83.19,140.33 70.48,127.63 CNA5.8
GAIN4_A
  Bottom 0.61: CONN_MIXER_A1.8 CONN_MIXER_A_STM32.2 76.83,144.14 71.12,138.43 58.42,138.43 48.89,128.91 CNA3.6
GAIN4_B
  Bottom 0.61: CONN_MIXER_B1.8 CONN_MIXER_B_STM32.2 94.62,143.51 81.92,130.81 78.11,130.81 75.56,128.27 CNA5.6
GND
  Bottom 0.61: CONN_3340.2 CONN_3340.4 CONN_3340.6 CONN_3340.8 CONN_3340.10 CONN_3340.12 CONN_3340.14 CONN_3340.16 | CONN_3340.16 CONN_3340.15 CONN_3340_STM32.8 | CONN_3340.16 CONN_13700.5 CONN_13700.3 CONN_13700.1 | CONN_13700.1 CONN_DRUM1.13 CONN_DRUM1.11 CONN_DRUM1.9 CONN_DRUM1.7 CONN_DRUM1.5 CONN_DRUM1.3 CONN_DRUM1.1 | CONN_DRUM1.1 CONN_MIXER_A1.9 CONN_MIXER_A1.7 CONN_MIXER_A1.5 CONN_MIXER_A1.3 CONN_MIXER_A1.1 | CONN_MIXER_A1.1 CONN_MIXER_B1.9 CONN_MIXER_B1.7 CONN_MIXER_B1.5 CONN_MIXER_B1.3 CONN_MIXER_B1.1 | CONN_MIXER_B1.1 CONN_MIXER_B1.2 CONN_MIXER_B_STM32.5 | CONN_MIXER_B1.1 CONN_VCF.2 | CONN_VCF.2 CONN_VCF.4 CONN_VCF.6 CONN_VCF.8 CONN_VCF.10 120.65,152.4 123.19,149.86 CONN_DAC_EN_RABE.2 CNA8.7 123.19,125.09 | CONN_13700.1 CONN_13700.2 CONN_13700_STM32.3 | CONN_DRUM1.1 CONN_DRUM1.2 CONN_DRUM_STM32.1 | CONN_MIXER_A_STM32.5 CONN_MIXER_A1.2 CONN_MIXER_A1.1 | CONN_VCF.2 CONN_VCF.1 109.22,146.69 CONN_VCF_STM32.1 | 21.59,93.98 RPI_TO_STM32.1 53.97,91.44 55.25,90.17 67.31,90.17 | 21.59,93.98 20.95,94.61 CONN_RPI.2 CONN_RPI.4 CONN_RPI.6 CONN_RPI.8 | 123.19,125.09 122.56,124.46 117.48,124.46 CDEC4.2 CNA7.5 107.95,124.46 103.51,124.46 | 123.19,125.09 123.83,124.46 127.64,124.46 128.27,125.09 | 128.27,125.09 CNA8.5 | 103.51,124.46 102.87,125.09 CNA7.7 | 39.37,124.46 46.99,124.46 | 46.99,124.46 52.07,124.46 | 52.07,124.46 59.69,124.46 | 59.69,124.46 64.77,124.46 | 64.77,124.46 73.66,124.46 | 73.66,124.46 78.74,124.46 | 78.74,124.46 85.09,124.46 | 85.09,124.46 90.81,124.46 | 90.81,124.46 95.89,124.46 | 95.89,124.46 103.51,124.46 | CDEC5.2 83.82,125.73 85.09,124.46 | CDEC6.2 39.37,124.46
  Bottom 0.61: CDEC3.2 7.62,124.46 13.97,124.46 | 13.97,124.46 19.05,124.46 | 19.05,124.46 27.3,124.46 | 27.3,124.46 32.39,124.46 | 32.39,124.46 39.37,124.46 | CNA1.7 12.7,125.73 13.97,124.46 | CNA1.5 17.78,125.73 19.05,124.46 | 128.27,125.09 128.91,125.09 130.17,123.82 130.17,116.2 128.27,114.3 CONN_ALIM.1 CONN_ALIM.2 CDEC2.2 CDEC1.2 128.27,91.44 127.64,90.8 | CNA6.7 90.17,125.09 90.81,124.46 | CNA5.7 73.03,125.09 73.66,124.46 | CNA5.5 78.11,125.09 78.74,124.46 | CNA4.5 64.14,125.09 64.77,124.46 | CNA4.7 59.06,125.09 59.69,124.46 | CNA3.5 51.44,125.09 52.07,124.46 | CNA3.7 46.36,125.09 46.99,124.46 | 127.64,90.8 125.09,88.27 110.49,88.27 107.95,85.72 67.95,85.72 67.31,86.36 67.31,90.17 | CNA2.7 26.04,125.73 27.3,124.46 | CNA2.5 31.12,125.73 32.39,124.46 | CNA6.5 95.25,125.09 95.89,124.46 | 127.64,90.8 129.54,88.9 U$1.CN2-1 U$1.CN2-2 | 67.31,90.17 67.31,100.33 69.22,102.23 78.11,102.23 80.01,100.33 DECODEUR_CNA.5 80.01,97.79 81.28,96.52 87,96.52 87.63,97.16 DECODEUR_CNA.8 | 23.5,74.29 40.64,74.29 U$1.CN9-23 | 23.5,74.29 8.26,74.29 7.62,74.93 7.62,92.07 9.53,93.98 21.59,93.98 | U$1.CN9-12 55.88,63.5 55.25,62.86 28.58,62.86 | 23.5,74.29 23.5,66.67 27.3,62.86 28.58,62.86 | U$1.CN3-1 U$1.CN3-2 126.37,17.07 126.37,25.4 125.73,26.03 108.59,26.03 | U$1.CN10-17 53.34,31.11 | 53.34,31.11 40.64,31.11 | 40.64,31.11 U$1.CN10-27 | U$1.CN10-22 48.26,21.59 29.21,21.59 28.58,22.22 28.58,30.48 29.21,31.11 | 29.21,31.11 40.64,31.11 | 53.34,31.11 68.58,31.11 | 68.58,31.11 U$1.CN10-5 | 68.58,31.11 107.95,31.11 108.59,30.48 108.59,26.03 | 108.59,26.03 108.59,22.86 107.31,21.59 93.98,21.59 92.96,22.61 U$1.CN7-8 | 29.21,31.11 29.21,62.23 28.58,62.86
  pour Bottom (isolate 1.016): 0,158.75 137.79,158.75 137.79,-0.64 0,-0.64
  pour Top (isolate 1.016): 0,158.75 137.79,158.75 137.79,83.82 0,83.82
IN_2NDORDER
  Bottom 0.61: CONN_VCF.7 116.84,146.69 CONN_VCF_STM32.4
IN_4THORDER
  Bottom 0.61: CONN_VCF.9 119.38,146.69 CONN_VCF_STM32.5
N$1
  Bottom 0.61: DECODEUR_CNA.1 69.85,92.07 71.75,90.17 CONN_STM32.1
N$2
  Bottom 0.61: DECODEUR_CNA.2 72.39,93.98 73.66,92.71 81.92,92.71 82.55,92.07 CONN_STM32.2
N$3
  Bottom 0.61: DECODEUR_CNA.3 74.93,95.88 76.83,93.98 83.19,93.98 85.09,92.07 CONN_STM32.3
N$7
  Bottom 0.61: CONN_DAC_EN_RABE.3 CNA8.8
N$8
  Bottom 0.61: CONN_DAC_EN_RABE.1 CNA8.6
NOISE_GENE
  Bottom 0.61: CONN_DRUM1.14 CONN_DRUM_STM32.7 43.18,140.33 40,140.33 28.58,128.91 CNA2.6
RPI_5V
  Bottom 0.61: RPI_TO_STM32.2 56.52,95.88 55.88,96.52 CONN_RPI.1
RPI_CE
  Bottom 0.61: RPI_TO_STM32.3 59.06,97.79 57.78,99.06 CONN_RPI.3
RPI_CLK
  Bottom 0.61: RPI_TO_STM32.4 61.59,99.06 59.06,101.6 CONN_RPI.5
RPI_MOSI
  Bottom 0.61: RPI_TO_STM32.5 64.14,100.97 60.96,104.14 CONN_RPI.7
SMT32_CS
  Bottom 0.61: DECODEUR_CNA.4 77.47,96.52 78.74,95.25 84.45,95.25 87.63,92.07 CONN_STM32.4
STM32_CLK
  Bottom 0.61: CNA1.3 15.24,117.47 15.88,116.84 20.32,116.84 20.95,117.47 20.95,121.28 21.59,121.92 27.94,121.92 28.58,121.28 CNA2.3 28.58,117.47 29.21,116.84 33.66,116.84 34.29,117.47 34.29,121.28 34.92,121.92 48.26,121.92 48.89,121.28 CNA3.3 48.89,117.47 49.53,116.84 53.34,116.84 53.97,117.47 53.97,121.28 54.61,121.92 60.33,121.92 61.59,120.65 CNA4.3 61.59,117.47 62.23,116.84 66.67,116.84 67.31,117.47 67.31,121.28 67.95,121.92 74.3,121.92 75.56,120.65 CNA5.3 75.56,117.47 76.2,116.84 80.01,116.84 80.65,117.47 80.65,121.28 81.28,121.92 92.08,121.92 92.71,121.28 CNA6.3 92.71,117.47 93.34,116.84 97.16,116.84 97.79,117.47 97.79,121.28 98.42,121.92 104.78,121.92 105.41,121.28 CNA7.3 105.41,116.2 111.12,116.2 111.76,116.84 111.76,120.65 113.03,121.92 125.09,121.92 125.73,121.28 CNA8.3 125.73,116.84 121.29,112.39 109.86,112.39 93.34,95.88 90.81,95.88 90.17,95.25 CONN_STM32.5
STM32_MOSI
  Bottom 0.61: 108.59,123.19 127.64,123.19 128.27,122.55 CNA8.4 128.27,116.84 121.92,110.49 111.76,110.49 92.71,91.44 CONN_STM32.6 | 108.59,123.19 96.52,123.19 | 108.59,123.19 107.95,122.55 CNA7.4 | CNA6.4 95.25,121.92 96.52,123.19 | CNA1.4 17.78,122.55 18.41,123.19 32.39,123.19 | 96.52,123.19 79.38,123.19 | 79.38,123.19 65.41,123.19 | 65.41,123.19 52.7,123.19 | 52.7,123.19 32.39,123.19 | CNA2.4 31.12,121.92 32.39,123.19 | CNA5.4 78.11,121.92 79.38,123.19 | CNA4.4 64.14,121.92 65.41,123.19 | CNA3.4 51.44,121.92 52.7,123.19
Y0
  Bottom 0.61: DECODEUR_CNA.15 72.39,107.95 71.12,109.22 15.24,109.22 12.7,111.76 CNA1.2
Y1
  Bottom 0.61: DECODEUR_CNA.14 74.93,108.58 73.03,110.49 26.04,110.49 CNA2.2
Y2
  Bottom 0.61: CNA3.2 46.36,111.76 74.93,111.76 77.47,109.22 DECODEUR_CNA.13
Y3
  Bottom 0.61: CNA4.2 59.06,113.03 78.74,113.03 80.01,111.76 DECODEUR_CNA.12
Y4
  Bottom 0.61: CNA5.2 73.03,116.2 73.66,115.57 79.38,115.57 82.55,112.39 DECODEUR_CNA.11
Y5
  Bottom 0.61: CNA6.2 90.17,116.2 85.09,111.12 DECODEUR_CNA.10
Y6
  Bottom 0.61: CNA7.2 102.87,112.39 101.6,111.12 89.54,111.12 87.63,109.22 DECODEUR_CNA.9
Y7
  Bottom 0.61: CNA8.2 123.19,116.2 121.29,114.3 108.59,114.3 96.52,102.23 87,102.23 85.09,100.33 DECODEUR_CNA.7

### Text on the board
Top: THeMiS DAC+STM32 v2 [TOP]
Bottom: THeMiS DAC+STM32 v2 [BOTTOM]